# Altium schematic sheet 3-Wire ISCV Driver.SchDoc: Ravage - 3-Wire ISCV Driver
size A4; Address1: Drawn By:; Address2: Dan Visser; DocumentNumber: A; Revision: 0.1-alpha; SheetNumber: 13; SheetTotal: 16
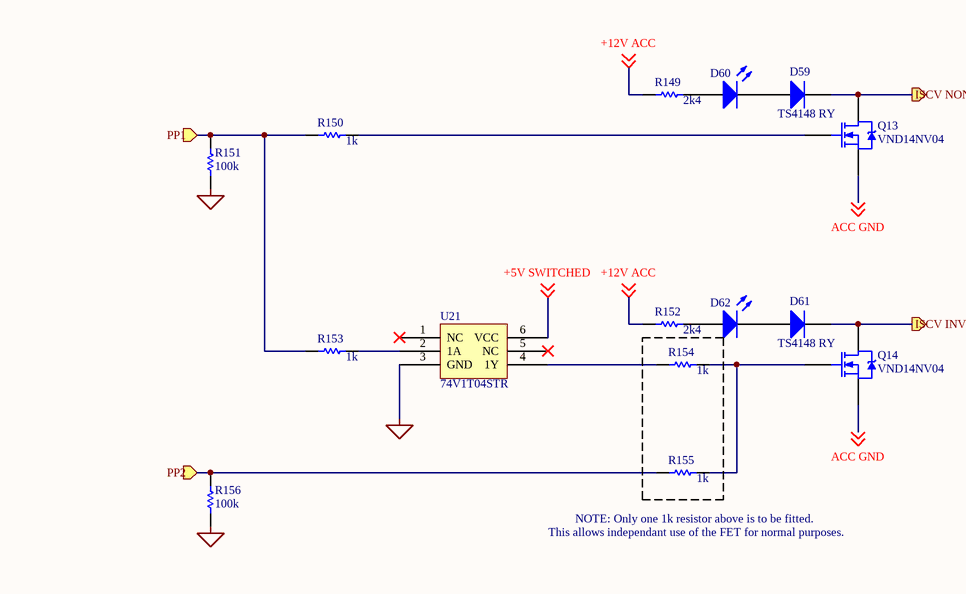
[diagram p0: 3-Wire ISCV Driver.SchDoc]

## Parts
D59  TS4148 RY  [SMC]
D60  (no value)  [LED-0]
D61  TS4148 RY  [SMC]
D62  (no value)  [LED-0]
Q13  VND14NV04  [TO-220AB]
Q14  VND14NV04  [TO-220AB]
R149  value 2k4  [AXIAL-0.3]
R150  value 1k  [AXIAL-0.3]
R151  value 100k  [AXIAL-0.3]
R152  value 2k4  [AXIAL-0.3]
R153  value 1k  [AXIAL-0.3]
R154  value 1k  [AXIAL-0.3]
R155  value 1k  [AXIAL-0.3]
R156  value 100k  [AXIAL-0.3]
U21  74V1T04STR

## Ports
ISCV INV (out), ISCV NON-INV (out), PP1 (in), PP2 (in)

## Nets
NetR151_1: R151.1 R156.1 U21.3(GND)
+5V SWITCHED: U21.6(VCC) ; off-sheet +5V SWITCHED
+12V ACC: R149.1 R152.1 ; off-sheet +12V ACC
ACC GND: Q13.3(S) Q14.3(S) ; off-sheet ACC GND
ISCV INV: D61.2(K) Q14.2(D) ; port ISCV INV
ISCV NON-INV: D59.2(K) Q13.2(D) ; port ISCV NON-INV
PP1: R150.1 R151.2 R153.1 ; port PP1
PP2: R155.1 R156.2 ; port PP2
NetD59_1: D59.1(A) D60.2(K)
NetD60_1: D60.1(A) R149.2
NetD61_1: D61.1(A) D62.2(K)
NetD62_1: D62.1(A) R152.2
NetQ13_1: Q13.1(G) R150.2
NetQ14_1: Q14.1(G) R154.2 R155.2
NetR153_2: R153.2 U21.2(1A)
NetR154_1: R154.1 U21.4(1Y)

Not connected (* = marked no-connect by the designer): U21 1(NC)* 5(NC)*

## Notes on the sheet
- This allows independant use of the FET for normal purposes.
- (near R155) NOTE: Only one 1k resistor above is to be fitted.
- Title
- Size:
- Date:
- A4
- Number:
- Time:
- Revision:
- Sheet
- of

## Library data of the parts
D59 D61 = Diode: Default Diode; Published: 8-Jun-2000; LatestRevisionDate: 17-Jul-2002; LatestRevisionNote: Re-released for DXP Platform.; PackageVersion: Sep-1996; PackageReference: SMC; Publisher: Altium Limited; PackageDescription: DO-214-AB/SMC; 2 C-Bend Leads; Body 7.9 x 5.9 mm, inc. leads (LxW); Code_JEDEC: DO-214-AB
D60 D62 = LED0: Typical INFRARED GaAs LED; Published: 8-Jun-2000; LatestRevisionDate: 08-Jul-2005; LatestRevisionNote: Mech Layer 1 removed.; PackageReference: LED-0; Publisher: Altium Limited; PackageDescription: LED; 2 Leads
Q13 Q14 = IRL520N: HEXFET Power MOSFET; Note: Pin 2 is electrically connected to pin 4 (Drain).; Published: 8-Jun-2000; LatestRevisionDate: 17-Jul-2002; LatestRevisionNote: Re-released for DXP Platform.; DatasheetVersion: May-1998; PackageVersion: Feb-1997; PackageReference: TO-220AB; Publisher: Altium Limited; PackageDescription: TO, Thru-Hole, Vertical, Heatsink Mounted; 3 In-Line Leads; Pitch 2.54 mm; ComponentLink1Description: Manufacturer Link; ComponentLink1URL: http://www.irf.com/; ComponentLink2Description: Datasheet; ComponentLink2URL: http://www.irf.com/product-info/datasheets/data/irl520n.pdf
R149-R156 = Res1: Resistor; Published: 8-Jun-2000; LatestRevisionDate: 17-Jul-2002; LatestRevisionNote: Re-released for DXP Platform.; PackageReference: AXIAL-0.3; Publisher: Altium Limited; PackageDescription: Axial Device, Thru-Hole; 2 Leads; 0.3 in Pin Spacing